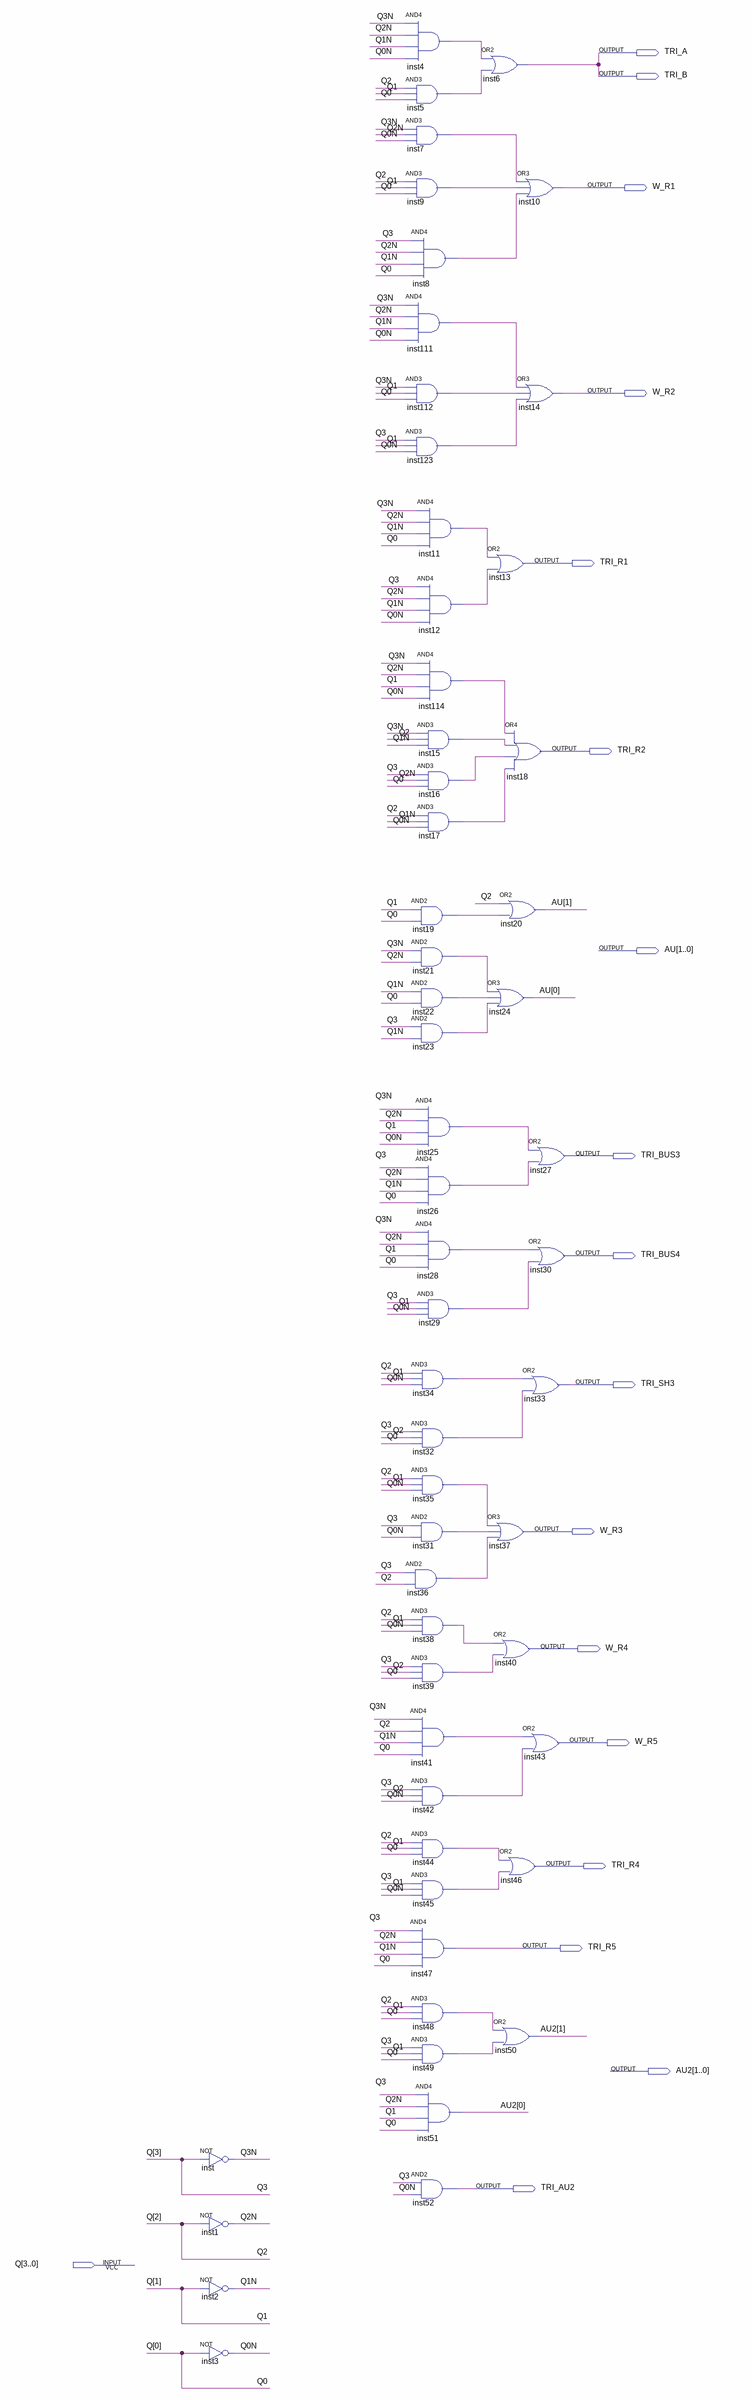
[diagram p0: schematic sheet]
// Quartus schematic ENCODER.bdf as structural Verilog: 57 symbols, 18 pins
module ENCODER (
  input  [3:0] Q,
  output TRI_A,
  output TRI_B,
  output W_R1,
  output W_R2,
  output TRI_R1,
  output TRI_R2,
  output [1:0] AU,
  output TRI_BUS3,
  output TRI_BUS4,
  output TRI_SH3,
  output W_R3,
  output W_R4,
  output W_R5,
  output TRI_R4,
  output TRI_R5,
  output [1:0] AU2,
  output TRI_AU2
);

  wire inst4_out, inst5_out, inst7_out, inst8_out, inst9_out, inst11_out, inst12_out, inst15_out, inst16_out,
       inst17_out, inst19_out, inst21_out, inst22_out, inst23_out, inst25_out, inst26_out, inst28_out,
       inst29_out, inst31_out, inst32_out, inst34_out, inst35_out, inst36_out, inst38_out, inst39_out,
       inst41_out, inst42_out, inst44_out, inst45_out, inst48_out, inst49_out, inst111_out, inst112_out,
       inst114_out, inst123_out, Q0N, Q1N, Q2N, Q3N;

  not inst (Q3N, Q[3]);
  not inst1 (Q2N, Q[2]);
  not inst2 (Q1N, Q[1]);
  not inst3 (Q0N, Q[0]);
  and inst4 (inst4_out, Q3N, Q2N, Q1N, Q0N);
  and inst5 (inst5_out, Q[2], Q[1], Q[0]);
  and inst7 (inst7_out, Q3N, Q2N, Q0N);
  and inst9 (inst9_out, Q[2], Q[1], Q[0]);
  and inst111 (inst111_out, Q3N, Q2N, Q1N, Q0N);
  and inst112 (inst112_out, Q3N, Q[1], Q[0]);
  and inst123 (inst123_out, Q[3], Q[1], Q0N);
  and inst36 (inst36_out, Q[3], Q[2]);
  and inst41 (inst41_out, Q3N, Q[2], Q1N, Q[0]);
  and inst47 (TRI_R5, Q[3], Q2N, Q1N, Q[0]);
  and inst8 (inst8_out, Q[3], Q2N, Q1N, Q[0]);
  and inst11 (inst11_out, Q3N, Q2N, Q1N, Q[0]);
  and inst12 (inst12_out, Q[3], Q2N, Q1N, Q0N);
  and inst114 (inst114_out, Q3N, Q2N, Q[1], Q0N);
  and inst15 (inst15_out, Q3N, Q[2], Q1N);
  and inst16 (inst16_out, Q[3], Q2N, Q[0]);
  and inst17 (inst17_out, Q[2], Q1N, Q0N);
  and inst19 (inst19_out, Q[1], Q[0]);
  and inst21 (inst21_out, Q3N, Q2N);
  and inst22 (inst22_out, Q1N, Q[0]);
  and inst23 (inst23_out, Q[3], Q1N);
  and inst25 (inst25_out, Q3N, Q2N, Q[1], Q0N);
  and inst26 (inst26_out, Q[3], Q2N, Q1N, Q[0]);
  and inst28 (inst28_out, Q3N, Q2N, Q[1], Q[0]);
  and inst29 (inst29_out, Q[3], Q[1], Q0N);
  and inst34 (inst34_out, Q[2], Q[1], Q0N);
  and inst32 (inst32_out, Q[3], Q[2], Q[0]);
  and inst35 (inst35_out, Q[2], Q[1], Q0N);
  and inst31 (inst31_out, Q[3], Q0N);
  and inst38 (inst38_out, Q[2], Q[1], Q0N);
  and inst39 (inst39_out, Q[3], Q[2], Q[0]);
  and inst42 (inst42_out, Q[3], Q[2], Q0N);
  and inst44 (inst44_out, Q[2], Q[1], Q[0]);
  and inst45 (inst45_out, Q[3], Q[1], Q0N);
  and inst48 (inst48_out, Q[2], Q[1], Q[0]);
  and inst49 (inst49_out, Q[3], Q[1], Q[0]);
  and inst51 (AU2[0], Q[3], Q2N, Q[1], Q[0]);
  and inst52 (TRI_AU2, Q[3], Q0N);
  or inst6 (TRI_A, inst4_out, inst5_out);
  or inst13 (TRI_R1, inst11_out, inst12_out);
  or inst20 (AU[1], Q[2], inst19_out);
  or inst24 (AU[0], inst21_out, inst22_out, inst23_out);
  or inst37 (W_R3, inst35_out, inst31_out, inst36_out);
  or inst40 (W_R4, inst38_out, inst39_out);
  or inst46 (TRI_R4, inst44_out, inst45_out);
  or inst50 (AU2[1], inst48_out, inst49_out);
  or inst10 (W_R1, inst7_out, inst9_out, inst8_out);
  or inst14 (W_R2, inst111_out, inst112_out, inst123_out);
  or inst18 (TRI_R2, inst114_out, inst15_out, inst16_out, inst17_out);
  or inst27 (TRI_BUS3, inst25_out, inst26_out);
  or inst30 (TRI_BUS4, inst28_out, inst29_out);
  or inst33 (TRI_SH3, inst34_out, inst32_out);
  or inst43 (W_R5, inst41_out, inst42_out);

  assign TRI_B = TRI_A;
endmodule
